# EAGLE board SX-150 Mk II (MIDI THT Proto E7) (EAGLE 7.4.0)
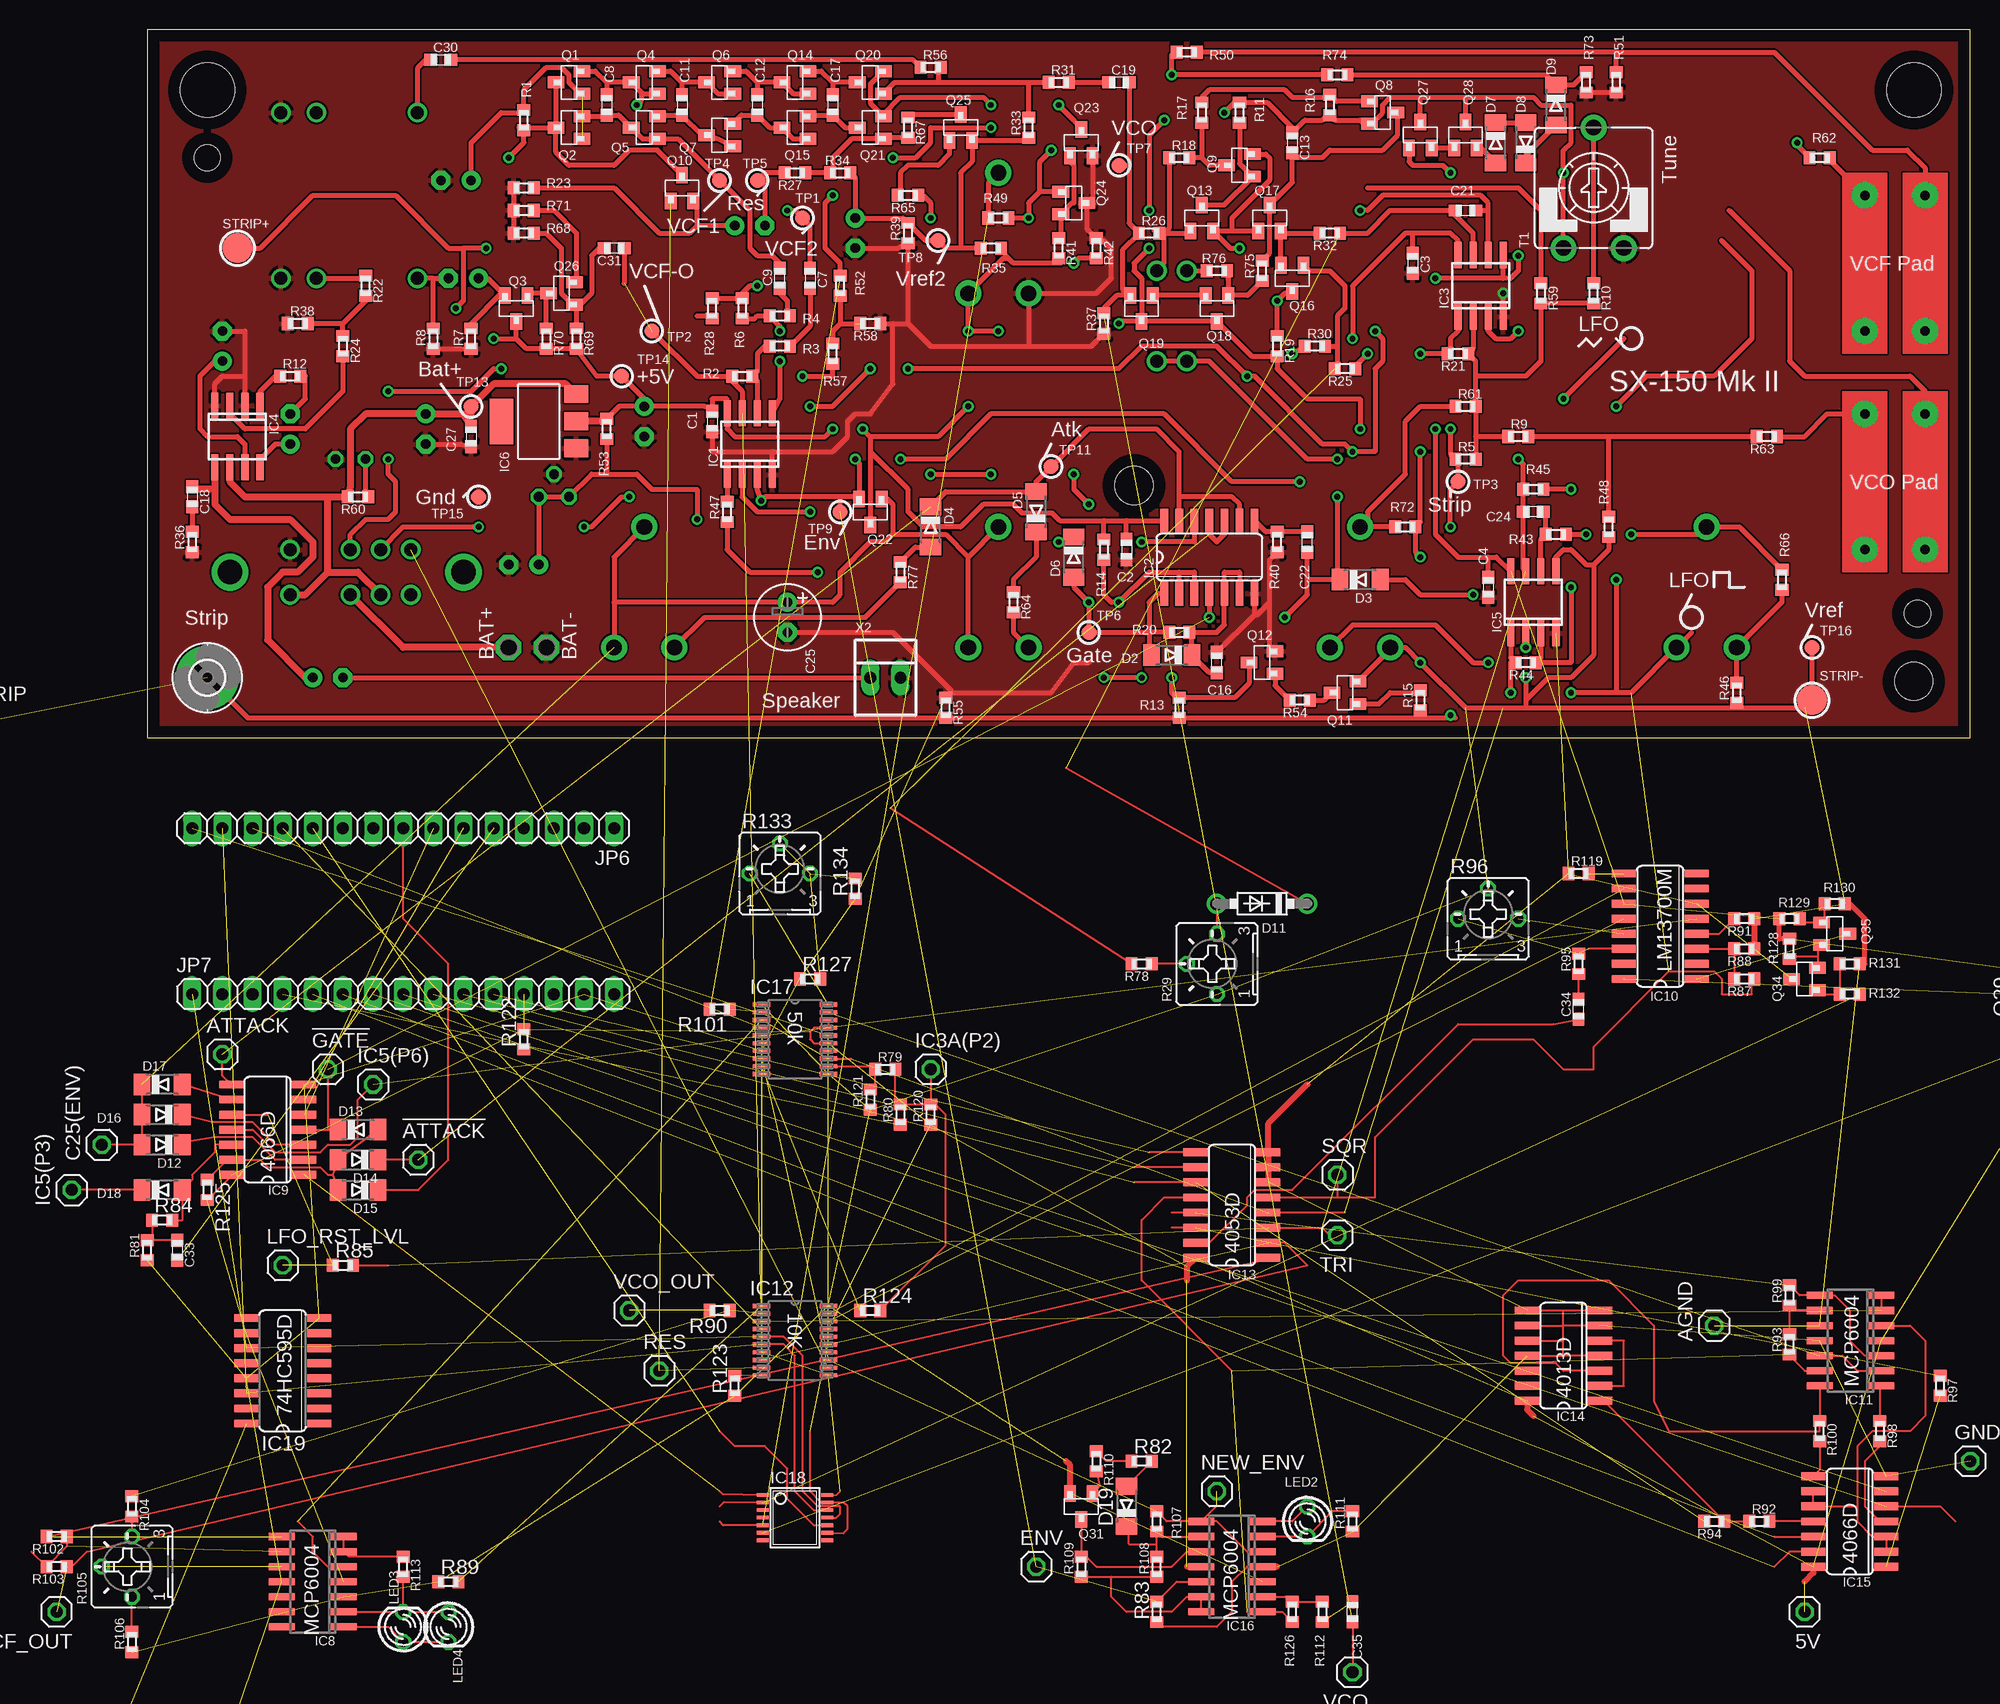
[diagram p2: board, top side]
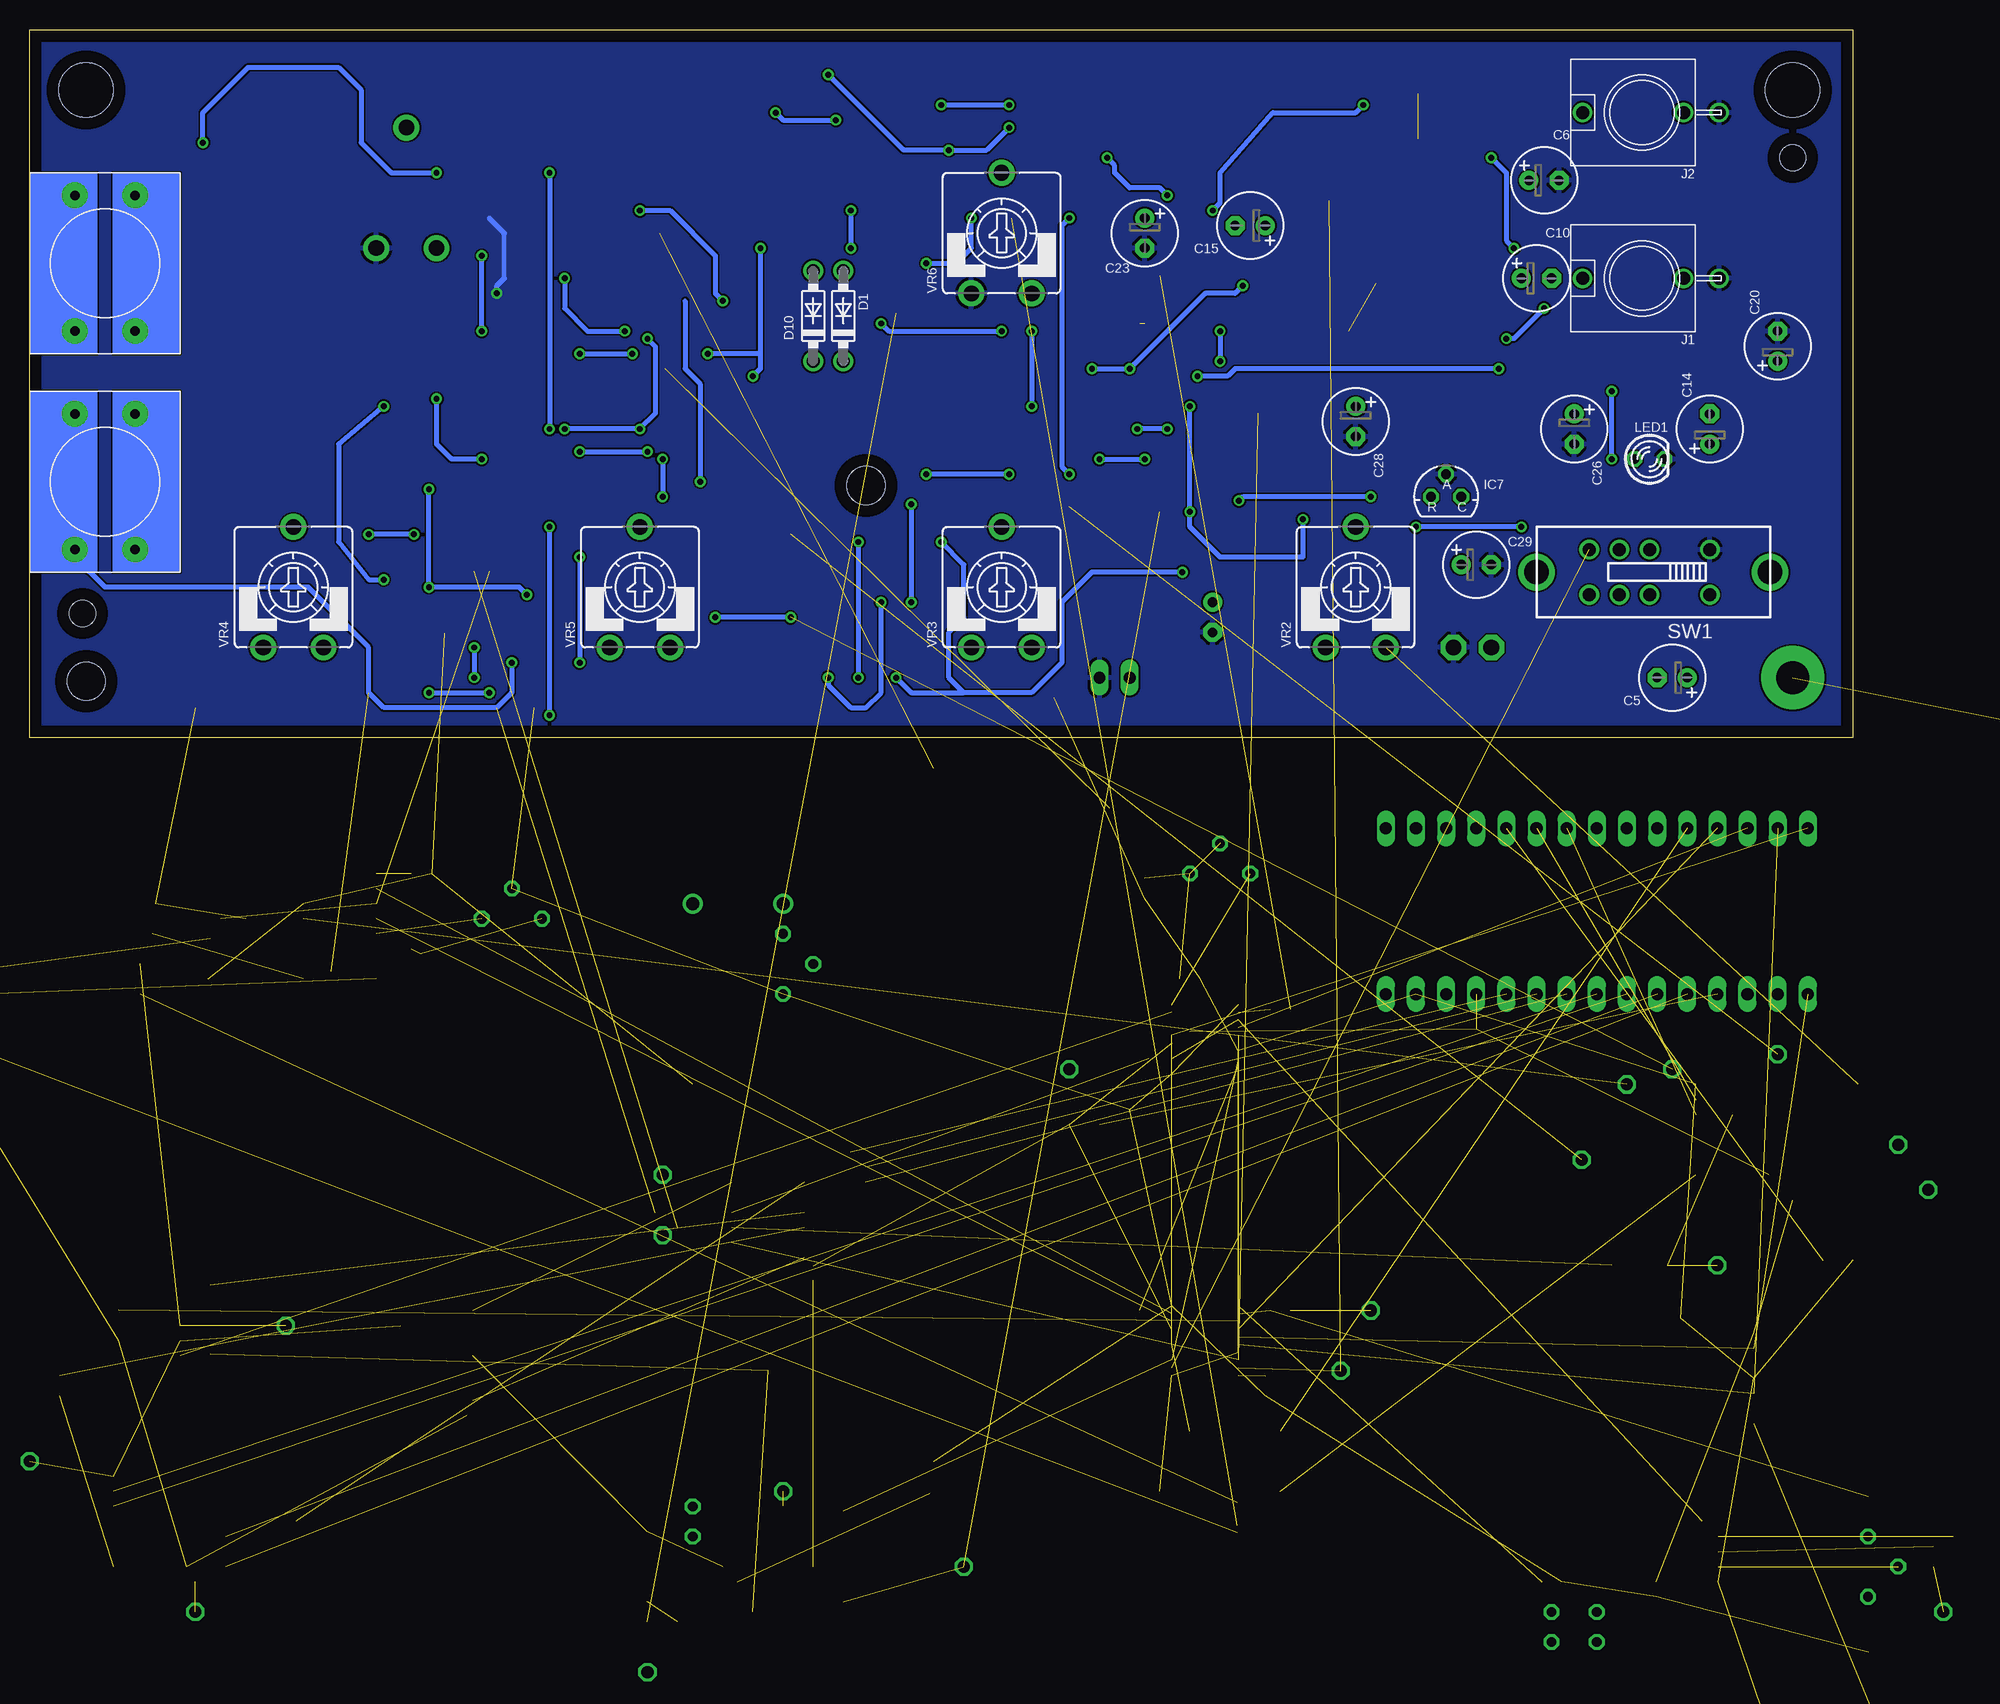
[diagram p3: board, bottom side, seen from below]

Size 153.67 x 59.69 mm. Coordinates in mm from the lower left corner, seen from the top.
Outline: 0,0 153.65,0 153.67,59.69 0,59.69 0,0
Copper layers (1*16): Top 0.035mm / dielectric 1.5mm / Bottom 0.035mm
Design rules "default": minimum track width 6mil, minimum drill 0.35mm, track to track 6mil, track to pad 6mil, pad to pad 6mil, via to via 6mil, smd to smd 6mil, copper to edge 40mil, drill to drill 6mil, minimum pad ring 10mil, minimum via ring 8mil, stop-mask expansion 4mil, vias tented up to drill 0mil, thermal gap 10mil
Net classes: 1 power: width 0.508 mm
Holes 3.2 mm at 83.19,21.27 148.91,4.76
Holes 4.57 mm at 148.91,54.61 5.08,54.61
Holes 2.2 mm at 5.08,48.9 149.22,10.48

## Footprints (pad centres in the part's own frame; a part is rotated, then mirrored left to right if it is on the bottom)
1X01 = drill 1.016 octagon: 1 0,0
P1-13 = drill 1.321 pad 2.159 octagon: TP 0,0
C0603 = smd 1.1 x 1: 1 -0.85,0; 2 0.85,0
E2,5-6 = drill 0.813 pad 1.6: + -1.27,0 | drill 0.813 pad 1.6 octagon: - 1.27,0
DO41-7.6 = drill 1.1 pad 1.7: A 3.81,0; C -3.81,0
MINIMELF = smd 1.4 x 1.8: A 1.7,0; C -1.7,0
GAKKEN-PAD = drill 0.8 pad 2.184: A0 -2.54,5.715; A1 -2.54,-5.715; B0 2.54,5.715; B1 2.54,-5.715
2,8-PAD = drill 2.8 pad 5.334: B2,8 0,0
SO08 = smd 0.6 x 2.2: 1 -1.905,-2.6; 2 -0.635,-2.6; 3 0.635,-2.6; 4 1.905,-2.6; 5 1.905,2.6; 6 0.635,2.6; 7 -0.635,2.6; 8 -1.905,2.6
SO14 = smd 0.66 x 2.032: 1 -3.81,-3.073; 2 -2.54,-3.073; 3 -1.27,-3.073; 4 0,-3.073; 5 1.27,-3.073; 6 2.54,-3.073; 7 3.81,-3.073; 8 3.81,3.073; 9 2.54,3.073; 10 1.27,3.073; 11 0,3.073; 12 -1.27,3.073; 13 -2.54,3.073; 14 -3.81,3.073
SOT223 = smd 1.499 x 2.007: 1 -2.261,-3.15; 2 0.025,-3.15; 3 2.311,-3.15 | smd 3.81 x 2.007: 4 0,3.15
TO92-CLP = drill 0.813 octagon: A 0,1.905; C 1.27,0; R -1.27,0
SO14' = smd 0.6 x 2.2: 1 -3.81,-2.6; 2 -2.54,-2.6; 3 -1.27,-2.6; 4 0,-2.6; 5 1.27,-2.6; 6 2.54,-2.6; 7 3.81,-2.6; 8 3.81,2.6; 9 2.54,2.6; 10 1.27,2.6; 11 0,2.6; 12 -1.27,2.6; 13 -2.54,2.6; 14 -3.81,2.6
SO16 = smd 0.66 x 2.032: 1 -4.445,-3.073; 2 -3.175,-3.073; 3 -1.905,-3.073; 4 -0.635,-3.073; 5 0.635,-3.073; 6 1.905,-3.073; 7 3.175,-3.073; 8 4.445,-3.073; 9 4.445,3.073; 10 3.175,3.073; 11 1.905,3.073; 12 0.635,3.073; 13 -0.635,3.073; 14 -1.905,3.073; 15 -3.175,3.073; 16 -4.445,3.073
TSSOP20_MC_MCH = smd 1.473 x 0.356: 1 -2.819,2.925; 2 -2.819,2.275; 3 -2.819,1.625; 4 -2.819,0.975; 5 -2.819,0.325; 6 -2.819,-0.325; 7 -2.819,-0.975; 8 -2.819,-1.625; 9 -2.819,-2.275; 10 -2.819,-2.925; 11 2.819,-2.925; 12 2.819,-2.275; 13 2.819,-1.625; 14 2.819,-0.975; 15 2.819,-0.325; 16 2.819,0.325; 17 2.819,0.975; 18 2.819,1.625; 19 2.819,2.275; 20 2.819,2.925
TSSOP14 = smd 0.305 x 0.991: 1 -1.905,-2.718; 2 -1.27,-2.718; 3 -0.635,-2.718; 4 0,-2.718; 5 0.635,-2.718; 6 1.27,-2.718; 7 1.905,-2.718; 8 1.905,2.718; 9 1.27,2.718; 10 0.635,2.718; 11 0,2.718; 12 -0.635,2.718; 13 -1.27,2.718; 14 -1.905,2.718
JACK-3.5-NOHOLE = drill 1.1: 1 0,5; 2 0,-3.5; 3 0,-6.5
1X15 = drill 1.016 long: 1 -17.78,0; 2 -15.24,0; 3 -12.7,0; 4 -10.16,0; 5 -7.62,0; 6 -5.08,0; 7 -2.54,0; 8 0,0; 9 2.54,0; 10 5.08,0; 11 7.62,0; 12 10.16,0; 13 12.7,0; 14 15.24,0; 15 17.78,0
LED3MM = drill 0.813 octagon: A -1.27,0; K 1.27,0
SOT23-BEC = smd 1 x 1.4: B -0.95,-1.1; C 0,1.1; E 0.95,-1.1
R0603 = smd 1 x 1.1: 1 -0.85,0; 2 0.85,0
B25P = drill 0.813 octagon: A -2.54,0; E 2.54,0; S 0,2.54
B2,54 = smd 2.54 x 2.54: TP 0,0
SP3T = drill 1.1: 0 -4.445,1.905; 1 0.635,1.905; 2 3.175,1.905; 3 5.715,1.905; 4 -4.445,-1.905; 5 0.635,-1.905; 6 3.175,-1.905; 7 5.715,-1.905 | drill 2.083: P$1 -9.525,0; P$2 10.16,0
CA9V = drill 1.321 pad 2.184: A -2.54,-5.08; E 2.54,-5.08; S 0,5.08
B1,27 = smd 1.27 x 1.27: TP 0,0
22-23-2021 = drill 1 long: 1 -1.27,0; 2 1.27,0

## Placement (x,y rotation side)
5V  [1X01]  139.7,-73.66 180 top  (outside the outline)
!ATTACK  [1X01]  22.86,-35.56 0 top  (outside the outline)
!GATE  [1X01]  15.24,-27.94 0 top  (outside the outline)
AGND  [1X01]  132.08,-49.53 90 top  (outside the outline)
ATTACK  [1X01]  6.35,-26.67 0 top  (outside the outline)
BAT+  TPPAD1-13  [P1-13]  30.48,7.62 90 top
BAT-  TPPAD1-13  [P1-13]  33.66,7.62 90 top
C1  100n  [C0603]  47.62,26.67 270 top
C2  100n  [C0603]  82.55,15.88 270 top
C3  100n  [C0603]  106.68,40.01 270 top
C4  100n  [C0603]  113.03,12.7 270 top
C5  220u  [E2,5-6]  15.24,5.08 180 bottom
C6  10u/16v  [E2,5-6]  26.04,46.99 0 bottom
C7  100n  [C0603]  55.88,38.73 270 top
C8  33n  [C0603]  38.73,53.34 270 top
C9  100n  [C0603]  53.34,38.73 90 top
C10  10u/10v  [E2,5-6]  26.67,38.73 0 bottom
C11  33n  [C0603]  45.09,53.34 270 top
C12  33n  [C0603]  51.44,53.34 270 top
C13  33n  [C0603]  96.52,50.16 270 top
C14  10u/10v  [E2,5-6]  12.06,26.04 90 bottom
C15  4.7u/10V  [E2,5-6]  50.8,43.18 180 bottom
C16  33n  [C0603]  90.17,6.35 90 top
C17  12n  [C0603]  57.78,53.34 270 top
C18  47n  [C0603]  3.81,20.32 270 top
C19  1u  [C0603]  81.92,55.24 180 top
C20  10u/10v  [E2,5-6]  6.35,33.02 90 bottom
C21  1n  [C0603]  111.12,44.45 180 top
C22  100p  [C0603]  97.79,16.51 90 top
C23  220u/5v  [E2,5-6]  59.69,42.55 270 bottom
C24  100n  [C0603]  116.84,19.05 180 top
C25  100u/16v  [E2,5-6]  53.98,10.16 270 top
C25(ENV)  [1X01]  -3.81,-34.29 90 top  (outside the outline)
C26  100u/16v  [E2,5-6]  23.5,26.04 270 bottom
C27  100n  [C0603]  27.3,25.4 270 top
C28  100u/16v  [E2,5-6]  41.91,26.67 270 bottom
C29  220u/10v  [E2,5-6]  31.75,14.61 0 bottom
C30  4.7u  [C0603]  24.77,57.15 0 top
C31  4.7u  [C0603]  39.37,41.27 180 top
C33  1n  [C0603]  2.54,-43.18 270 top  (outside the outline)
C34  4.7u  [C0603]  120.65,-22.86 90 top  (outside the outline)
C35  1u  [C0603]  101.6,-73.66 90 top  (outside the outline)
D1  [DO41-7.6]  85.09,35.56 90 bottom
D2  [MINIMELF]  86.36,6.99 180 top
D3  [MINIMELF]  102.23,13.34 0 top
D4  [MINIMELF]  66.04,17.78 270 top
D5  [MINIMELF]  74.93,19.05 90 top
D6  [MINIMELF]  78.11,15.24 270 top
D7  [MINIMELF]  113.67,50.16 270 top
D8  [MINIMELF]  116.2,50.16 90 top
D9  [MINIMELF]  118.75,53.34 270 top
D10  [DO41-7.6]  87.63,35.56 90 bottom
D11  [DO41-7.6]  93.98,-13.97 180 top  (outside the outline)
D12  [MINIMELF]  1.27,-34.29 180 top  (outside the outline)
D13  [MINIMELF]  17.78,-33.02 0 top  (outside the outline)
D14  [MINIMELF]  17.78,-35.56 180 top  (outside the outline)
D15  [MINIMELF]  17.78,-38.1 180 top  (outside the outline)
D16  [MINIMELF]  1.27,-31.75 180 top  (outside the outline)
D17  [MINIMELF]  1.27,-29.21 0 top  (outside the outline)
D18  [MINIMELF]  1.27,-38.1 0 top  (outside the outline)
D19  [MINIMELF]  82.55,-64.77 90 top  (outside the outline)
ENV  [1X01]  74.93,-69.85 0 top  (outside the outline)
FINGERPAD2  GAKKEN-PAD  [GAKKEN-PAD]  147.32,21.59 0 bottom
GND  [1X01]  153.67,-60.96 0 top  (outside the outline)
H1  MOUNT-PAD-ROUND2.8  [2,8-PAD]  5.08,5.08 0 top
IC1  LM358D  [SO08]  50.8,24.77 0 top
IC2  74HC02D  [SO14]  89.53,15.24 0 top
IC3  LM358D  [SO08]  112.39,38.1 0 top
IC3A(P2)  [1X01]  66.04,-27.94 0 top  (outside the outline)
IC4  LM386M-1  [SO08]  7.62,25.4 180 top
IC5  NJU7096  [SO08]  116.84,11.43 0 top
IC5(P3)  [1X01]  -6.35,-38.1 90 top  (outside the outline)
IC5(P6)  [1X01]  19.05,-29.21 0 top  (outside the outline)
IC6  REG1117  [SOT223]  33.02,26.67 90 top
IC7  TL431  [TO92-CLP]  34.29,20.32 0 bottom
IC8  MCP6004  [SO14']  13.97,-71.12 90 top  (outside the outline)
IC9  4066D  [SO14]  10.16,-33.02 90 top  (outside the outline)
IC10  LM13700M  [SO16]  127.53,-15.88 90 top  (outside the outline)
IC11  MCP6004  [SO14']  143.57,-50.8 90 top  (outside the outline)
IC12  10K  [TSSOP20_MC_MCH]  54.61,-50.8 0 top  (outside the outline)
IC13  4053D  [SO16]  91.44,-39.37 90 top  (outside the outline)
IC14  4013D  [SO14]  119.38,-52.07 90 top  (outside the outline)
IC15  4066D  [SO14]  143.51,-66.04 90 top  (outside the outline)
IC16  MCP6004  [SO14']  91.44,-69.85 90 top  (outside the outline)
IC17  50k  [TSSOP20_MC_MCH]  54.61,-25.4 0 top  (outside the outline)
IC18  BD79702FV  [TSSOP14]  54.61,-65.72 270 top  (outside the outline)
IC19  74HC595D  [SO16]  11.43,-53.34 90 top  (outside the outline)
IC20  4051D  [SO16]  -7.62,-110.49 0 top  (outside the outline)
J1  PJ301M  [JACK-3.5-NOHOLE]  17.78,38.73 90 bottom
J2  Line In  [JACK-3.5-NOHOLE]  17.78,52.7 90 bottom
JP6  [1X15]  21.59,-7.62 180 top  (outside the outline)
JP7  [1X15]  21.59,-21.59 0 top  (outside the outline)
LED1  [LED3MM]  17.14,23.5 0 bottom
LED2  [LED3MM]  97.79,-66.04 270 top  (outside the outline)
LED3  [LED3MM]  21.59,-74.93 90 top  (outside the outline)
LED4  [LED3MM]  25.4,-74.93 270 top  (outside the outline)
LFO_RST_LVL  [1X01]  11.43,-44.45 0 top  (outside the outline)
NEW_ENV  [1X01]  90.17,-63.5 0 top  (outside the outline)
PAD1  GAKKEN-PAD  [GAKKEN-PAD]  147.32,40.01 180 bottom
Q1  2SC2712  [SOT23-BEC]  35.56,55.24 90 top
Q2  2SC2712  [SOT23-BEC]  35.56,51.44 90 top
Q3  2SC2712  [SOT23-BEC]  31.11,36.2 180 top
Q4  2SC2712  [SOT23-BEC]  41.91,55.24 90 top
Q5  2SC2712  [SOT23-BEC]  41.91,51.44 90 top
Q6  2SC2712  [SOT23-BEC]  48.26,55.24 90 top
Q7  2SC2712  [SOT23-BEC]  48.26,50.8 90 top
Q8  2SA1162  [SOT23-BEC]  104.14,52.7 270 top
Q9  2SC2712  [SOT23-BEC]  92.08,48.26 90 top
Q10  2SC2712  [SOT23-BEC]  45.09,46.35 0 top
Q11  2SA1162  [SOT23-BEC]  100.97,3.81 90 top
Q12  2SC2712  [SOT23-BEC]  93.98,6.35 90 top
Q13  2SC2712  [SOT23-BEC]  88.9,43.81 0 top
Q14  2SC2712  [SOT23-BEC]  54.61,55.24 90 top
Q15  2SC2712  [SOT23-BEC]  54.61,51.44 90 top
Q16  2SC2712  [SOT23-BEC]  96.52,38.73 180 top
Q17  2SC2712  [SOT23-BEC]  94.61,43.81 0 top
Q18  2SC2712  [SOT23-BEC]  90.17,36.2 180 top
Q19  2SC2712  [SOT23-BEC]  83.82,36.2 180 top
Q20  2SC2712  [SOT23-BEC]  60.96,55.24 90 top
Q21  2SC2712  [SOT23-BEC]  60.96,51.44 90 top
Q22  2SC2712  [SOT23-BEC]  60.96,19.05 180 top
Q23  2SC2712  [SOT23-BEC]  78.74,50.16 0 top
Q24  2SA1162  [SOT23-BEC]  78.11,45.09 270 top
Q25  2SC2712  [SOT23-BEC]  68.58,51.44 0 top
Q26  2SC2712  [SOT23-BEC]  34.92,37.47 90 top
Q27  2SC2712  [SOT23-BEC]  107.31,50.8 0 top
Q28  2SC2712  [SOT23-BEC]  111.12,50.8 0 top
Q29  2SA1162  [SOT23-BEC]  158.75,-21.59 90 top  (outside the outline)
Q31  2SC2712  [SOT23-BEC]  78.74,-64.77 180 top  (outside the outline)
Q34  2SA1162  [SOT23-BEC]  139.7,-20.32 90 top  (outside the outline)
Q35  2SA1162  [SOT23-BEC]  142.24,-16.51 270 top  (outside the outline)
R1  10k  [R0603]  31.75,52.07 270 top
R2  2.2M  [R0603]  50.16,30.48 180 top
R3  47k  [R0603]  53.34,33.02 180 top
R4  47k  [R0603]  53.34,35.56 180 top
R5  1M  [R0603]  111.12,23.5 0 top
R6  47k  [R0603]  50.16,36.2 270 top
R7  4.7k  [R0603]  27.3,33.66 90 top
R8  100k  [R0603]  24.13,33.66 90 top
R9  2.2M  [R0603]  115.57,25.4 180 top
R10  1M  [R0603]  121.92,37.47 270 top
R11  22k  [R0603]  92.08,52.7 90 top
R12  10k  [R0603]  12.06,30.48 0 top
R13  1M  [R0603]  87,2.54 90 top
R14  1M  [R0603]  80.64,15.88 90 top
R15  10k  [R0603]  107.31,3.17 90 top
R16  680Ω  [R0603]  99.69,53.34 270 top
R17  1k  [R0603]  88.9,52.7 90 top
R18  68k  [R0603]  87,48.9 0 top
R19  220k  [R0603]  95.25,33.02 270 top
R20  220k  [R0603]  87,8.89 0 top
R21  470k  [R0603]  110.49,32.38 180 top
R22  47k  [R0603]  18.41,38.1 270 top
R23  22k  [R0603]  31.75,46.35 0 top
R24  0Ω  [R0603]  16.51,33.02 270 top
R25  33k  [R0603]  100.97,31.11 180 top
R26  47k  [R0603]  84.45,42.55 0 top
R27  2.2k  [R0603]  54.61,47.62 180 top
R28  1k  [R0603]  47.62,36.2 270 top
R29  5k  [B25P]  90.17,-19.05 90 top  (outside the outline)
R30  2.2k  [R0603]  98.42,33.02 0 top
R31  47k  [R0603]  76.83,55.24 180 top
R32  1k  [R0603]  99.69,42.55 180 top
R33  2.2k  [R0603]  74.3,51.44 90 top
R34  2.2k  [R0603]  58.42,47.62 180 top
R35  6.8k  [R0603]  71.12,41.27 0 top
R36  10Ω  [R0603]  3.81,16.51 90 top
R37  10k  [R0603]  80.64,34.92 90 top
R38  1.5k  [R0603]  12.7,34.92 0 top
R39  2.4k  [R0603]  64.14,42.55 90 top
R40  330k  [R0603]  95.25,16.51 90 top
R41  2.2M  [R0603]  76.83,41.27 270 top
R42  2.2k  [R0603]  80.01,41.27 270 top
R43  22k  [R0603]  118.75,17.14 0 top
R44  47k  [R0603]  116.2,6.35 180 top
R45  22k  [R0603]  116.84,20.95 0 top
R46  10Ω  [R0603]  133.99,3.81 90 top
R47  330k  [R0603]  48.9,19.05 90 top
R48  1k  [R0603]  123.19,17.78 90 top
R49  56k  [R0603]  71.75,43.81 0 top
R50  27k  [R0603]  87.63,57.78 180 top
R51  1k  [R0603]  123.83,55.24 90 top
R52  27k  [R0603]  58.42,38.1 90 top
R53  1k  [R0603]  38.73,26.04 90 top
R54  10k  [R0603]  97.16,3.17 180 top
R55  1M  [R0603]  67.31,2.54 270 top
R56  22k  [R0603]  66.04,56.52 0 top
R57  4.7k  [R0603]  57.78,32.38 90 top
R58  4.7k  [R0603]  60.96,34.92 180 top
R59  1M  [R0603]  117.47,37.47 270 top
R60  2.2k  [R0603]  17.78,20.32 180 top
R61  2.2M  [R0603]  111.12,27.94 0 top
R62  1k  [R0603]  140.97,48.9 180 top
R63  4.7k  [R0603]  136.53,25.4 180 top
R64  120Ω  [R0603]  73.03,11.43 270 top
R65  39k  [R0603]  64.14,45.72 180 top
R66  2.2k  [R0603]  137.79,13.34 90 top
R67  1k  [R0603]  64.14,51.44 270 top
R68  100k  [R0603]  31.75,42.55 0 top
R69  220k  [R0603]  36.2,33.66 270 top
R70  22k  [R0603]  33.66,33.66 270 top
R71  10k  [R0603]  31.75,44.45 0 top
R72  33k  [R0603]  106.05,17.78 180 top
R73  4.7k  [R0603]  121.28,55.24 90 top
R74  120k  [R0603]  100.33,55.88 180 top
R75  10k  [R0603]  93.98,39.37 90 top
R76  27k  [R0603]  90.17,39.37 0 top
R77  0Ω  [R0603]  63.5,13.97 270 top
R78  470k  [R0603]  83.82,-19.05 180 top  (outside the outline)
R79  470k  [R0603]  62.23,-27.94 0 top  (outside the outline)
R80  120k  [R0603]  63.5,-31.75 90 top  (outside the outline)
R81  100k  [R0603]  0,-43.18 90 top  (outside the outline)
R82  100k  [R0603]  83.82,-60.96 0 top  (outside the outline)
R83  10k  [R0603]  85.09,-73.66 90 top  (outside the outline)
R84  1k  [R0603]  1.27,-40.64 0 top  (outside the outline)
R85  4.7k  [R0603]  16.51,-44.45 0 top  (outside the outline)
R86  10k  [R0603]  162.56,-20.32 0 top  (outside the outline)
R87  100k  [R0603]  134.62,-20.32 180 top  (outside the outline)
R88  1k  [R0603]  134.62,-17.78 180 top  (outside the outline)
R89  3.3k  [R0603]  25.4,-71.12 0 top  (outside the outline)
R90  10k  [R0603]  48.26,-48.26 180 top  (outside the outline)
R91  1k  [R0603]  134.62,-15.24 180 top  (outside the outline)
R92  33k  [R0603]  135.89,-66.04 0 top  (outside the outline)
R93  100k  [R0603]  138.43,-51.12 90 top  (outside the outline)
R94  22k  [R0603]  132.08,-66.04 180 top  (outside the outline)
R95  47k  [R0603]  120.65,-19.05 90 top  (outside the outline)
R96  1k  [B25P]  113.03,-15.24 0 top  (outside the outline)
R97  24.9k  [R0603]  151.13,-54.61 270 top  (outside the outline)
R98  100k  [R0603]  146.05,-58.42 270 top  (outside the outline)
R99  100k  [R0603]  138.43,-46.99 90 top  (outside the outline)
R100  100k  [R0603]  140.97,-58.42 270 top  (outside the outline)
R101  100k?  [R0603]  48.26,-22.86 180 top  (outside the outline)
R102  100k  [R0603]  -7.62,-67.31 180 top  (outside the outline)
R103  100k  [R0603]  -7.62,-69.85 180 top  (outside the outline)
R104  100k  [R0603]  -1.27,-64.77 270 top  (outside the outline)
R105  50k  [B25P]  -1.27,-69.85 90 top  (outside the outline)
R106  10k  [R0603]  -1.27,-76.2 90 top  (outside the outline)
R107  100k  [R0603]  85.09,-66.04 90 top  (outside the outline)
R108  100k  [R0603]  85.09,-69.85 90 top  (outside the outline)
R109  100k  [R0603]  78.74,-69.85 90 top  (outside the outline)
R110  47k  [R0603]  80.01,-60.96 270 top  (outside the outline)
R111  2.2k  [R0603]  101.6,-66.04 90 top  (outside the outline)
R112  100k  [R0603]  99.06,-73.66 90 top  (outside the outline)
R113  1k  [R0603]  21.59,-69.85 270 top  (outside the outline)
R116  470k  [R0603]  162.56,-22.86 0 top  (outside the outline)
R117  100k  [R0603]  161.29,-25.4 0 top  (outside the outline)
R119  4.7k  [R0603]  120.65,-11.43 0 top  (outside the outline)
R120  1M  [R0603]  66.04,-31.75 90 top  (outside the outline)
R121  33k  [R0603]  60.96,-30.48 90 top  (outside the outline)
R122  10Ω  [R0603]  31.75,-25.4 90 top  (outside the outline)
R123  1k  [R0603]  49.53,-54.61 90 top  (outside the outline)
R124  470k  [R0603]  60.96,-48.26 0 top  (outside the outline)
R125  10k  [R0603]  5.08,-38.1 270 top  (outside the outline)
R126  220k  [R0603]  96.52,-73.66 270 top  (outside the outline)
R127  68k  [R0603]  55.88,-20.32 0 top  (outside the outline)
R128  4.7k  [R0603]  138.43,-17.78 90 top  (outside the outline)
R129  33k  [R0603]  138.43,-15.24 180 top  (outside the outline)
R130  2.2k  [R0603]  142.24,-13.97 180 top  (outside the outline)
R131  2.2k  [R0603]  143.51,-19.05 180 top  (outside the outline)
R132  47k  [R0603]  143.51,-21.59 180 top  (outside the outline)
R133  20k  [B25P]  53.34,-11.43 0 top  (outside the outline)
R134  100k  [R0603]  59.69,-12.7 90 top  (outside the outline)
RES  [1X01]  43.18,-53.34 0 top  (outside the outline)
SQR  [1X01]  100.33,-36.83 0 top  (outside the outline)
STRIP  [1X01]  -13.97,1.27 0 top  (outside the outline)
STRIP+  TPB2,54  [B2,54]  7.62,41.27 0 top
STRIP-  TPB2,54  [B2,54]  140.34,3.17 0 top
SW1  SP3T  [SP3T]  16.51,13.97 180 bottom
T1  50k  [CA9V]  121.92,46.35 0 top
TP1  PTR1B1,27  [B1,27]  55.24,43.81 180 top
TP2  PTR1B1,27  [B1,27]  42.55,34.29 0 top
TP3  PTR1B1,27  [B1,27]  110.49,21.59 0 top
TP4  PTR1B1,27  [B1,27]  48.26,46.99 0 top
TP5  PTR1B1,27  [B1,27]  51.44,46.99 0 top
TP6  PTR1B1,27  [B1,27]  79.38,8.89 90 top
TP7  PTR1B1,27  [B1,27]  81.92,48.26 0 top
TP8  PTR1B1,27  [B1,27]  66.67,41.91 0 top
TP9  PTR1B1,27  [B1,27]  58.42,19.05 180 top
TP11  PTR1B1,27  [B1,27]  76.2,22.86 0 top
TP13  PTR1B1,27  [B1,27]  27.3,27.94 0 top
TP14  PTR1B1,27  [B1,27]  40.01,30.48 0 top
TP15  PTR1B1,27  [B1,27]  27.94,20.32 180 top
TP16  PTR1B1,27  [B1,27]  140.34,7.62 0 top
TRI  [1X01]  100.33,-41.91 180 top  (outside the outline)
VCF_OUT  [1X01]  -7.62,-73.66 180 top  (outside the outline)
VCO  [1X01]  101.6,-78.74 180 top  (outside the outline)
VCO_OUT  [1X01]  40.64,-48.26 0 top  (outside the outline)
VR2  50k  [CA9V]  41.91,12.7 0 bottom
VR3  10k  [CA9V]  71.75,12.7 0 bottom
VR4  50k  [CA9V]  131.44,12.7 0 bottom
VR5  50k  [CA9V]  102.23,12.7 0 bottom
VR6  10k  [CA9V]  71.75,42.55 0 bottom
X2  Speaker Out  [22-23-2021]  62.23,5.08 0 top

## Tracks (layer width: path | path; a pad name or v marks a point on that pad's centre or on a via)
!ATTACK  (1 unrouted)
  Top 0.152: !ATTACK.1 D14.C
  Top 0.406: IC2.11 89.53,17.14 90.17,16.51 90.81,17.14 IC2.10
!CS1  (1 unrouted)
!CS2  (1 unrouted)
!CS3  (1 unrouted)
  Top 0.152: IC18.10 56.23,-66.39 53.98,-64.14 53.98,-61.59 52.07,-59.69 49.53,-59.69 48.26,-58.42
!GATE  (via drill 0.5)  (1 unrouted)
  Top 0.152: IC9.4 15.24,-33.02 | 15.24,-33.02 D13.C | !GATE.1 15.24,-33.02
  Top 0.406: IC2.4 v89.53,10.16 | v95.89,10.16 97.79,12.06 97.79,13.34 | 97.79,13.34 C22.1 | D3.C 100.33,13.34 | 100.33,13.34 97.79,13.34 | D1.C D10.C 89.53,31.75 97.79,23.5 v100.33,23.5 | v100.33,20.32 100.33,13.34
  Bottom 0.406: v89.53,10.16 v95.89,10.16 | v100.33,23.5 v100.33,20.32
!SAW  (1 unrouted)
  Top 0.152: R99.2 139.28,-46.99 IC11.8 142.24,-46.99 143.51,-48.26 143.51,-50.8 144.78,-52.07 IC11.3 | IC13.13 86.36,-40.01
+5V  (via drill 0.5)  (20 unrouted)
  Top 0.152: IC17.18 IC17.17 56.22,-24.43 55.88,-24.77 55.88,-25.4 56.2,-25.73 IC17.15 | R125.2 7.09,-36.94 IC9.14 | IC18.9 58.69,-67.05 59.05,-66.67 59.05,-64.77 58.73,-64.44 IC18.13 56.83,-64.44 55.88,-63.5 55.88,-58.42
  Top 0.406: Q1.C Q2.C | Q2.C 31.33,51.44 R1.2 31.75,50.16 v30.48,48.9 | Q10.C 43.01,49.53 40.64,49.53 39.37,48.26 35.56,48.26 34.46,49.36 Q2.C | v28.57,41.27 26.67,41.27 | 26.67,41.27 25.4,41.27 20.95,45.72 13.97,45.72 9.53,41.27 STRIP+.TP | 26.67,41.27 26.67,36.83 v26.04,36.2 | v29.21,33.66 31.11,33.66 | 31.11,33.66 Q3.C | 31.11,33.66 31.96,32.8 R70.2 R69.2 37.88,30.48 TP14.TP 41.91,28.57 C28.+ | Q27.C 107.31,53.98 | 107.31,53.98 111.12,53.98 | 107.31,53.98 104.78,53.98 104.14,53.34 104.14,52.7 103.19,51.76 Q8.E 102.55,51.76 102.23,52.07 100.11,52.07 R16.2 99.48,52.49 99.06,52.07 97.58,52.07 C13.1 96.52,51.44 94.4,53.55 R11.2 91.66,53.55 v90.81,52.7 | R41.2 77.05,40.01 73.03,40.01 72.61,40.42 | 72.61,40.42 R35.2 | 72.61,40.42 72.17,40.42 VR6.E v69.22,34.29 v71.75,34.29 | Q19.C Q18.C 93.09,32.17 R19.2 95.25,31.11 97.79,28.57 102.23,28.57 v102.23,26.04 | 60.96,24.13 64.14,20.95 64.14,19.05 65.41,17.78 68.58,17.78 70.48,19.68 73.03,19.68 73.76,18.95 76.3,18.95 76.94,18.31 80.64,18.31 | 60.96,24.13 Q22.C | v57.78,26.04 57.15,25.4 49.53,25.4 48.9,26.04 IC1.8 48.9,28.57 47.62,28.57 C1.1 46.99,27.94 C28.+ | 60.96,25.4 60.96,24.13 | IC3.8 110.49,41.91 109.86,42.55 106.68,42.55 | 106.68,42.55 106.05,42.55 101.6,38.1 v101.6,33.66 | v108.58,26.04 108.58,17.14 110.49,15.24 113.03,15.24 | 113.03,15.24 113.72,15.24 IC5.8 | Q28.C 111.12,53.98 | 111.12,53.98 116.84,53.98 117.47,53.34 120.02,53.34 120.02,50.16 119.38,49.53 v119.38,47.62 T1.A | C4.1 113.03,15.24 | C3.1 106.68,42.55 | Q19.C 82.08,35.09 v81.92,34.92 | v69.22,27.94 66.67,25.4 60.96,25.4 | 60.96,25.4 v60.33,26.04 | C28.+ 39.79,27.94 R53.2
  Top 0.406: v85.72,52.07 84.45,50.8 v84.45,44.45 | v84.45,41.27 83.19,40.01 83.19,39.37 83.82,38.73 Q19.C | 80.64,18.31 82.55,18.31 | 82.55,18.31 IC2.14 | R14.2 80.64,18.31 | C2.1 82.55,18.31 | v139.06,50.16 139.06,49.95 R62.2 | R128.2 137.58,-16.93 R129.2
  Top 0.508: IC15.14 140.44,-70.38 139.7,-71.12 | IC14.14 116.31,-56.62 116.84,-57.15 | IC16.11 87.63,-69.85 | IC13.16 87.63,-44.55 87.63,-45.72
  Top 0.61: R53.2 38.29,26.7 IC6.2
  Bottom 0.406: v30.48,48.9 29.21,47.62 29.21,41.91 v28.57,41.27 | v57.78,26.04 v60.33,26.04 | v101.6,33.66 100.97,33.02 100.97,27.3 v102.23,26.04 v108.58,26.04 | v81.92,34.92 81.28,34.29 v71.75,34.29 | v69.22,34.29 v69.22,27.94 | v139.06,50.16 139.06,52.7 135.25,56.52 127.64,56.52 125.73,54.61 125.73,50.16 123.19,47.62 v119.38,47.62 | v90.81,52.7 90.17,52.07 v85.72,52.07 | v84.45,44.45 v84.45,41.27 | v26.04,36.2 28.57,33.66 v29.21,33.66
AGND  (via drill 0.5)  (16 unrouted)
  Top 0.406: R28.1 R6.1 50.16,37.47 50.8,38.1 v51.44,38.1 | Q9.E 94.3,49.21 94.61,48.9 94.61,46.99 91.44,43.81 91.44,42.72 | Q17.B 91.44,42.72 | 91.44,42.72 Q13.E 91.29,41.27 v92.08,41.27 | IC3.3 113.03,34.29 113.67,33.66 114.94,33.66 v115.57,34.29 | v96.52,32.38 R30.1 | v115.57,40.64 115.57,39.37 114.94,38.73 114.3,38.73 | 114.3,38.73 IC3.5 | IC1.2 50.16,20.32 51.44,19.05 v55.88,19.05 | v55.88,27.94 57.78,27.94 v60.96,31.11 | 118.81,14.03 IC5.5 118.75,15.24 119.38,15.88 120.02,15.88 121.28,14.61 121.92,14.61 | Q11.E 104.78,7.47 VR5.A 106.05,7.62 v107.31,6.35 111.12,2.54 116.2,2.54 | 116.2,2.54 133.99,2.54 | IC5.2 v116.2,7.62 | v116.2,5.08 116.2,3.17 | 116.2,3.17 116.2,2.54 | v107.31,15.24 106.89,15.66 R72.1 107.31,18.2 v107.31,24.13 | v64.14,31.11 81.92,31.11 83.82,33.02 90.17,33.02 v92.71,30.48 93.34,30.48 99.06,24.77 100.97,24.77 v101.6,24.13 103.5,24.13 103.5,31.11 104.14,31.75 104.14,33.66 v103.5,34.29 | TP16.TP STRIP-.TP 139.7,2.54 133.99,2.54 | R46.1 133.99,2.54 | 121.92,14.61 121.92,6.99 120.02,5.08 118.11,5.08 116.2,3.17 | 114.3,38.73 v108.58,38.73 | C29.+ IC7.C IC7.R 37.47,22.23 38.73,22.23 | 38.73,22.23 41.27,22.23 42.55,20.95 46.35,20.95 v46.35,18.41 | R53.1 38.73,22.23 | R48.1 123.19,15.88 121.92,14.61 | R131.1 144.78,-19.05 144.78,-15.24 143.51,-13.97 R130.1
  Top 0.508: R91.1 R88.1 | Q31.E 77.79,-61.28 77.47,-60.96
  Bottom 0.406: v115.57,34.29 v115.57,40.64 | v92.08,41.27 92.08,32.38 | 92.08,32.38 v96.52,32.38 | v51.44,38.1 52.07,37.47 54.61,37.47 v60.96,31.11 v64.14,31.11 | v55.88,27.94 v55.88,19.05 55.88,17.78 53.34,15.24 46.35,15.24 v46.35,18.41 | v116.2,7.62 v116.2,5.08 | v107.31,15.24 v107.31,6.35 | v107.31,24.13 v101.6,24.13 | v108.58,38.73 108.58,36.2 106.68,34.29 v103.5,34.29 | 92.08,32.38 92.08,31.11 v92.71,30.48
ATK_PWM  (1 unrouted)
ATTACK  (1 unrouted)
  Top 0.152: IC9.8 6.35,-28.47 ATTACK.1
  Top 0.406: IC2.13 87,20.32 | 87,20.32 87,24.13 85.09,26.04 79.38,26.04 TP11.TP 74.93,21.59 D5.A 67.31,20.75 D4.C | IC2.9 92.08,19.68 91.44,20.32 87,20.32
C25  (1 unrouted)
  Top 0.152: D17.C D16.A D12.A C25(ENV).1
  Top 0.406: VR3.E 69.22,15.24 | 69.22,15.24 VR3.S | Q22.B 62.4,20.15 62.87,19.68 62.87,17.14 | 62.87,17.14 67.31,17.14 69.22,15.24 | 62.87,17.14 62.23,16.51 60.96,16.51 58.42,13.97 58.42,12.06 57.78,11.43 C25.+ 39.37,11.43 | VR2.S 39.37,15.24 39.37,11.43 | 39.37,11.43 VR2.E
DECAY_PWM
  Top 0.152: D15.C 22.86,-38.1 25.4,-35.56 25.4,-19.05 21.59,-15.24 JP6.8
ENV  (via drill 0.5)  (2 unrouted)
  Top 0.152: R83.2 86.78,-71.12 IC16.12
  Top 0.406: v97.16,21.59 91.44,21.59 85.72,27.3 71.12,27.3 67.31,23.5 v63.5,23.5 | v59.69,23.5 60.01,23.18 Q22.E 59.84,20.32 58.42,20.32 | 58.42,20.32 52.07,20.32 v51.75,20 51.44,20.95 IC1.3 | TP9.TP 58.42,20.32 | SW1.6 21.59,17.78 v27.94,17.78 | v36.83,17.78 37.47,17.78 40.01,20.32 v40.64,20.32
  Bottom 0.406: 98.42,36.83 98.42,31.11 97.16,29.84 v97.16,21.59 | v63.5,23.5 v59.69,23.5 | v27.94,17.78 v36.83,17.78 | v40.64,20.32 51.44,20.32 v51.75,20
ENV_INV
  Top 0.152: R82.1 80.86,-60.96 R110.1
FILTER_OUT
  Top 0.152: C34.1 118.53,-24.13 110.49,-24.13 96.52,-38.1 93.34,-38.1 92.71,-38.73 92.71,-39.37 89.53,-42.55 IC13.15
GATE  (via drill 0.5)
  Top 0.406: IC2.1 85.19,12.17 84.45,11.43 84.45,8.89 | 84.45,8.89 84.45,7.83 D2.A | R20.1 84.45,8.89 | D6.A 78.11,12.7 v79.38,11.43 TP6.TP 84.45,8.89 | R65.1 65.41,45.72 66.04,45.09 v66.04,43.81 | v66.04,22.23 v71.12,22.23 | v78.11,22.23 78.11,20.95 v79.38,19.68
  Bottom 0.406: v66.04,43.81 66.67,43.18 66.67,22.86 v66.04,22.23 | v71.12,22.23 v78.11,22.23 | v79.38,19.68 v79.38,11.43
GND  (via drill 0.5)  (24 unrouted)
  Top 0.152: IC14.8 119.38,-48.26 | 119.38,-48.26 IC14.7 | IC14.10 119.38,-50.8 | 119.38,-50.8 119.38,-49.53 | 119.38,-49.53 119.38,-48.26 | IC14.6 119.38,-49.53 | IC14.4 119.38,-52.07 | 119.38,-52.07 119.38,-50.8 | IC18.14 58.12,-63.8 58.42,-63.5 | IC14.9 119.38,-49.53 | IC14.11 119.38,-52.07 | IC16.4 92.71,-69.85 91.44,-71.12 91.44,-73.66 90.17,-74.93 85.51,-74.93 R83.1
  Top 0.406: R23.1 R71.1 R68.1 | R73.1 R51.1 | 79.06,45.23 Q24.C | C23.- 63.28,41.27 R39.1 64.14,34.92 | R58.1 62.87,34.92 | 62.87,34.92 64.14,34.92 | 64.14,34.92 66.04,33.02 74.3,33.02 | 74.3,33.02 79.59,33.02 R37.1 | 74.3,33.02 VR6.A 80.01,37.47 81.28,38.73 81.28,41.27 80.64,41.91 80.22,41.91 R42.1 79.2,42.93 Q24.C | IC3.4 v114.3,37.47 | C16.2 93.34,10.38 | 93.34,10.38 IC2.7 | Q12.E 94.61,7.76 94.61,11.43 | 94.61,11.43 94.61,15.03 R40.1 | 93.34,10.38 93.56,10.38 94.61,11.43 | C25.- 62.87,8.89 67.94,3.81 76.2,3.81 78.11,6.35 79.38,6.35 | R8.1 R7.1 | C1.2 47.62,24.13 52.7,24.13 | 52.7,24.13 57.78,24.13 59.05,25.4 59.05,26.67 59.69,27.3 60.96,27.3 62.87,29.84 62.87,34.92 | IC1.4 52.7,24.13 | C20.- 8.26,34.29 8.26,30.48 | 8.26,30.48 IC4.2 | IC4.4 5.71,29.84 6.35,30.48 8.26,30.48 | C26.- 26.45,24.77 C27.2 | Q23.E 79.69,45.57 Q24.C
  Top 0.508: IC16.4 95.25,-69.85 | 97.79,-29.21 94.51,-32.49 IC13.8 IC13.7 IC13.6
  Bottom 0.406: v114.3,37.47 114.3,38.1 113.67,38.73 113.67,42.55 114.94,43.81
  pour Top: 0,0 153.67,0 153.67,59.69 0,59.69
  pour Bottom: 0,0 153.67,0 153.67,59.69 0,59.69
GND1
  Top 0.406: R34.1 59.69,47.2 C23.+ 63.72,43.81 R39.2 65.62,41.91 TP8.TP 67.31,41.27 68.58,41.27 | R33.1 74.05,50.34 Q25.E 69.53,48.58 68.58,47.62 68.58,41.27 | R35.1 68.58,41.27
HP_OUT  (1 unrouted)
  Top 0.152: R102.2 94.4,-43.93 IC13.1
LFO  (via drill 0.5)  (4 unrouted)
  Top 0.152: IC8.5 15.24,-69.85 13.97,-68.58 13.97,-67.31 12.7,-66.04 | 100.97,-40.01 IC13.4 | IC17.13 59.34,-27.02
  Top 0.406: VR5.E 101.6,9.53 108.58,9.53 111.76,6.35 v113.03,6.35 | 133.35,44.45 138.43,39.37 138.43,31.75 139.7,30.48 148.59,30.48 149.86,29.21 FINGERPAD2.A0 FINGERPAD2.A1
  Bottom 0.406: v113.03,6.35 113.03,3.81 114.3,2.54 123.83,2.54 125.09,3.81 125.09,7.62 130.18,12.7 147.32,12.7 149.86,15.24 FINGERPAD2.A1
LFO_CV  (1 unrouted)
  Top 0.152: IC18.2 48.62,-64.42 48.26,-64.77
LFO_RST  (1 unrouted)
  Top 0.152: 2.54,-44.45 C33.2
LFO_SHAPE  (1 unrouted)
  Top 0.152: IC13.9 84.45,-34.92
MISO  (2 unrouted)
MOSI  (3 unrouted)
  Top 0.152: IC12.6 53.66,-51.12 54.61,-52.07 54.61,-63.5 56.2,-65.09 IC18.12
N$1
  Top 0.406: IC1.1 R47.2
N$2
  Top 0.406: D5.C 74.93,15.24 73.03,13.34 R64.1
N$3  (via drill 0.5)
  Top 0.406: Q12.C 92.88,4.62 91.66,3.39 R13.2 86.78,3.39 86.36,3.81 v86.36,5.08 | R14.1 80.64,12.06 81.28,11.43 v81.92,11.43 84.45,13.97 87,13.97 | 87,13.97 88.27,13.97 IC2.3 | IC2.2 87,13.97
  Bottom 0.406: v86.36,5.08 86.36,4.45 84.45,2.54 83.19,2.54 81.92,3.81 v81.92,11.43
N$4
  Top 0.152: IC9.2 10.79,-35.56 8.89,-33.66 5.71,-33.66 3.17,-34.09 | 3.17,-34.09 D12.C | 3.17,-34.09 3.6,-33.66
N$6
  Top 0.406: C22.2 R40.2 94.3,17.36 IC2.8
N$7
  Top 0.406: Q12.B 95.08,4.4 R54.2
N$8
  Top 0.406: C16.1 89.55,5.5 D2.C 88.06,8.68 R20.2 90.17,8.89 90.81,9.53 IC2.5 90.81,13.97 92.08,13.97 IC2.6
N$9  (via drill 0.5)
  Top 0.406: R47.1 48.9,15.88 50.8,13.97 v56.52,13.97 | v76.83,16.51 77.67,16.51 D6.C | IC2.12 88.27,16.51 v83.82,16.51 | v83.82,5.08 v80.64,5.08
  Bottom 0.406: 74.93,3.81 69.22,3.81 66.67,6.35 66.67,11.43 64.14,13.97 v56.52,13.97 | 74.93,3.81 76.2,5.08 76.2,8.89 74.93,10.16 74.93,14.61 v76.83,16.51 | v83.82,16.51 v83.82,5.08 | v80.64,5.08 79.38,3.81 74.93,3.81
N$10
  Top 0.406: R77.1 64.76,16.08 D4.A
N$11
  Top 0.152: IC9.9 D17.A
N$12
  Top 0.406: R64.2 73.03,8.89 VR3.A
N$13
  Top 0.152: D19.A R82.2
N$14
  Top 0.406: R54.1 99.23,3.17 Q11.C
N$15
  Top 0.406: Q11.B 103.83,2.86 104.78,3.81 107.1,3.81 R15.2
N$16
  Top 0.406: R72.2 102.87,17.78 | 102.87,17.78 VR5.S | R61.1 107.31,27.94 106.05,26.67 106.05,22.23 102.87,19.05 102.87,17.78
N$17  (1 unrouted)
  Top 0.152: IC9.11 8.89,-33.02 10.79,-34.92 14.61,-34.92 15.24,-34.29 17.14,-34.29 17.78,-33.66 17.78,-30.48 IC5(P6).1
N$18
  Top 0.406: R10.2 R59.2 117.47,31.75 116.2,30.48 111.97,30.48 | 111.97,25.4 R61.2 111.97,30.48 | 111.97,25.4 R5.2 | R9.2 111.97,25.4 | IC3.2 111.76,32.8 R21.1 111.97,31.75 111.97,30.48
N$19
  Top 0.152: D18.C IC5(P3).1
N$20
  Top 0.406: R66.1 137.79,11.43 VR4.A R46.2
N$21  (via drill 0.5)
  Top 0.406: R43.2 v121.28,17.14 | v125.09,17.14 130.81,17.14 VR4.S 134.2,17.78 R66.2
  Bottom 0.406: v121.28,17.14 v125.09,17.14
N$22  (via drill 0.5)
  Top 0.406: IC3.1 110.49,34.29 109.86,33.66 109.86,32.6 R21.2 v107.31,32.38 | v102.87,32.38 101.81,31.33 R25.1
  Bottom 0.406: v107.31,32.38 v102.87,32.38
N$23  (1 unrouted)
  Top 0.152: R78.2 62.65,-5.93
  Top 0.406: 100.33,33.02 100.33,35.56 100.97,36.2 100.97,38.1 99.69,39.37 97.94,39.37 Q16.B | 100.33,33.02 100.33,31.33 R25.2 | R30.2 100.33,33.02
N$24
  Top 0.406: 102.87,46.35 115.57,46.35 117.47,44.45 R59.1
N$25
  Top 0.406: R63.2 123.19,25.4 | 123.19,25.4 R9.1 | R48.2 123.19,25.4
N$26
  Top 0.406: R10.1 T1.S
N$27
  Top 0.406: 96.52,48.9 96.52,46.82 Q17.C 94.61,40.85 R75.2 | Q8.C 105.41,52.53 105.41,50.8 104.14,49.53 99.69,49.53 99.06,48.9 96.52,48.9 | 96.52,48.9 C13.2
N$28
  Top 0.406: R17.2 88.9,53.98 89.53,54.61 95.89,54.61 96.52,53.98 99.48,53.98 R16.1 100.23,53.66 Q8.B
N$29  (1 unrouted)
  Top 0.152: D11.C 77.47,-2.54
  Top 0.406: R32.1 102.87,42.55 104.78,44.45 C21.2 110.28,44.03 111.76,42.55 IC3.7
N$30
  Top 0.406: R32.2 95.73,42.55 Q17.E Q16.E
N$31  (via drill 0.5)
  Top 0.406: R19.1 v95.25,36.83 95.89,37.47 96.35,37.47 Q16.C | v102.23,44.45 102.87,44.45 104.14,45.72 112.39,45.72 113.03,45.09 113.03,44.45 | IC3.6 113.03,44.45 | C21.1 113.03,44.45
  Bottom 0.406: v102.23,44.45 99.69,44.45 95.89,40.64 95.89,37.47 v95.25,36.83
N$32
  Top 0.406: Q9.C 89.53,48.26 88.9,48.9 | 88.9,48.9 R18.2 | R17.1 88.9,48.9
N$33
  Top 0.406: R75.1 92.75,37.3 Q18.B 91.12,38.63 R76.2
N$34
  Top 0.406: Q18.E Q19.B
N$35
  Top 0.61: BAT+.TP 21.59,7.62 SW1.1
N$36
  Top 0.406: R11.1 92.08,48.41 Q9.B 90.78,44.91 Q13.C
N$37
  Top 0.406: 85.72,42.55 R26.2 84.88,42.75 | 85.72,42.55 87.78,42.55 Q13.B | D1.A 85.72,40.01 85.72,42.55 | R18.1 86.14,42.97 85.72,42.55
N$38
  Top 0.406: D10.A R76.1
N$39  (via drill 0.5)
  Top 0.406: Q1.E 37.78,56.2 38.73,55.24 | 38.73,55.24 C8.1 | 38.73,55.24 Q4.C 41.68,54.38 | 41.68,54.38 41.76,54.3 Q4.B | C7.1 55.88,43.18 TP1.TP 54.61,44.45 v53.98,44.45 | v41.27,53.34 41.68,53.74 41.68,54.38
  Bottom 0.406: v53.98,44.45 53.34,45.09 53.34,47.62 48.9,52.7 41.91,52.7 v41.27,53.34
N$40
  Top 0.406: Q2.E 38.63,52.38 C8.2 39.76,52.49 Q5.C 41.76,50.48 Q5.B 44.77,50.48 TP4.TP 50.8,44.45 50.8,41.27 51.44,40.64 52.7,40.64 53.34,40.01 C9.2
N$41  (1 unrouted)
  Top 0.406: Q1.B 36.51,54.3 35.56,55.24 35.56,55.88 34.92,56.52 33.66,56.52 31.75,54.61 R1.1 31.54,52.7 29.84,52.7 27.3,50.16 C6.+
N$42  (via drill 0.5)
  Top 0.406: v71.12,53.34 70.48,53.98 63.5,53.98 62.06,52.53 Q21.E 60.96,53.48 60.96,55.09 Q20.E | v76.83,53.34 78.11,52.07 Q23.C
  Bottom 0.406: v71.12,53.34 v76.83,53.34
N$43
  Top 0.406: Q4.E 44.13,56.2 45.09,55.24 | 45.09,55.24 C11.1 | 45.09,55.24 Q6.C 48.11,54.3 Q6.B
N$44
  Top 0.406: Q5.E 43.12,52.49 C11.2 46.77,50.8 Q7.C 48.11,50.48 Q7.B
N$45
  Top 0.406: Q20.B 63.01,55.24 66.67,55.24 | 66.67,55.24 74.3,55.24 | 74.3,55.24 R31.2 | R33.2 74.3,55.24 | R56.2 66.67,56.3 66.67,55.24
N$46
  Top 0.406: Q6.E 50.48,56.2 51.44,55.24 | 51.44,55.24 C12.1 | 51.44,55.24 Q14.C 54.46,54.3 Q14.B
N$47
  Top 0.406: Q7.E 50.1,52.49 C12.2 52.49,51.44 Q15.C 54.46,50.48 Q15.B
N$48
  Top 0.406: Q14.E 56.84,56.2 57.78,55.24 | 57.78,55.24 C17.1 | Q20.C 57.78,55.24
N$49
  Top 0.406: Q15.E 55.81,52.49 C17.2 58.84,51.44 Q21.C
N$50
  Top 0.406: R67.2 62.16,50.59 Q21.B 59.38,50.48 57.78,48.9 57.78,47.84 R34.2 R27.1
N$51
  Top 0.406: C7.2 55.88,34.71 R3.1
N$52
  Top 0.406: C9.1 53.34,37.47 53.98,36.83 53.98,35.77 R4.1
N$53
  Top 0.406: R3.2 52.07,33.02 51.44,32.38 51.44,30.9 R2.1 51.44,30.06 IC1.6
N$54  (via drill 0.5)
  Top 0.406: 52.27,35.34 R4.2 | R4.2 52.7,35.56 | v53.34,31.75 53.34,28.57 IC1.5 | v53.34,34.29 53.34,34.71 R4.2 | R6.2 51.22,35.34 51.44,35.56 R4.2
  Bottom 0.406: v53.34,34.29 v53.34,31.75
N$55
  Top 0.406: Q23.B 77.79,48.58 78.11,48.26 78.11,45.09 77.95,45.09 Q24.E 77,42.3 R41.1
N$56
  Top 0.406: Q25.C 64.39,52.53 R67.1
N$57
  Top 0.406: Q25.B 67.63,49.22 66.67,48.26 64.14,48.26 63.5,47.62 63.5,45.94 R65.2
N$58
  Top 0.406: R27.2 52.07,47.62 | 52.07,47.62 C15.- | TP5.TP 52.07,47.62
N$59
  Top 0.406: C15.+ 46.35,43.18 | 46.35,43.18 46.35,44.94 Q10.E | R23.2 39.37,46.35 43.18,42.55 45.72,42.55 46.35,43.18
N$60  (1 unrouted)
N$61
  Top 0.406: 46.35,35.56 47.41,35.56 R28.2
N$62  (1 unrouted)
N$63  (via drill 0.5)  (1 unrouted)
  Top 0.406: R74.2 v86.36,55.88 86.36,57.57 R50.2 | Q24.B 75.25,46.03 | 75.25,46.03 74.3,45.09 v74.3,43.81 R49.2 | R42.2 78.53,40.42 v78.11,40.01 | R52.2 58.42,40.01 57.15,41.27 57.15,45.09 v57.78,45.72 | v62.87,48.9 64.77,48.9 66.04,50.16 66.04,51.44 v71.12,51.44 | 75.25,46.03 75.25,48.58 v76.2,49.53
  Bottom 0.406: v78.11,40.01 75.56,40.01 74.3,41.27 v74.3,43.81 | v57.78,45.72 58.42,46.35 60.96,46.35 62.23,47.62 62.23,48.26 v62.87,48.9 | v71.12,51.44 73.03,49.53 v76.2,49.53 80.01,49.53 v86.36,55.88
N$64  (via drill 0.5)
  Top 0.406: SW1.5 17.14,17.14 18.41,18.41 20.32,18.41 20.95,19.05 20.95,21.59 20.32,22.23 v20.32,23.5 | v20.32,29.21 27.3,29.21 29.21,31.11 v29.84,31.11 | v55.24,30.48 57.78,30.48 R57.1
  Bottom 0.406: v20.32,23.5 v20.32,29.21 | v29.84,31.11 52.07,31.11 52.7,30.48 v55.24,30.48
N$65  (1 unrouted)
N$66  (1 unrouted)
  Top 0.406: R52.1 58.42,34.92 | 58.42,34.92 59.69,34.92 | 58.42,34.92 57.78,34.29 R57.2
N$67
  Top 0.406: 123.83,57.78 R50.1 | R51.2 123.83,57.78 | 123.83,57.78 137.16,57.78 145.41,49.53 148.37,49.53 149.86,48.04 PAD1.B1 PAD1.B0
N$68
  Top 0.406: R31.1 C19.2
N$69
  Top 0.406: R56.1 64.56,57.15 C30.2
N$70
  Top 0.406: C30.1 23.5,57.15 22.78,56.44 J2.1
N$71
  Top 0.406: C31.2 38.1,41.27 37.47,40.64 37.47,37.47 36.52,36.52 Q26.B | R68.2 33.66,42.55 34.92,41.27 34.92,37.47 35.88,36.52 Q26.B | Q26.B 36.2,36.34 R69.1
N$72
  Top 0.406: R70.1 33.66,37.3 Q26.C 32.23,37.47 Q3.B
N$73
  Top 0.406: R71.2 34.29,44.45 36.2,42.55 36.2,38.59 Q26.E
N$74
  Top 0.406: Q3.E 30.02,37.3 | Q3.E 30,37.47 29.84,37.47 27.3,34.92 R7.2 | C10.+ 28.73,38.73 Q3.E
N$75
  Top 0.406: R8.2 24.13,38.73 | 24.13,38.73 C10.- | 24.13,38.73 J1.1
N$76
  Top 0.406: Q28.B Q27.E
N$77
  Top 0.406: PAD1.A0 PAD1.A1 141.82,48.68 R62.1
N$78
  Top 0.406: Q28.E 112.43,49.7 D7.A
N$79
  Top 0.406: D7.C D8.A
N$80
  Top 0.406: D8.C 116.2,49.1 D9.A
N$81
  Top 0.406: R74.1 117.91,55.88 D9.C 120.23,55.04 R73.2
N$82
  Top 0.406: R63.1 139.7,25.4 141.6,27.3 FINGERPAD2.B0 FINGERPAD2.B1
N$83
  Top 0.406: IC4.7 8.26,24.77 7.62,25.4 5.08,25.4 4.45,26.04 4.45,30.48 5.71,31.75 C20.+
N$84
  Top 0.406: C14.+ 10.79,24.77 9.53,23.5 IC4.8
N$85
  Top 0.406: R12.1 10.79,30.48 9.53,29.21 IC4.1
N$86
  Top 0.406: C14.- 13.34,28.57 13.34,30.48 R12.2
N$87
  Top 0.406: 4.03,20.95 C18.1
  Top 0.61: 5.71,20.95 5.71,19.68 6.99,18.41 12.06,18.41 13.97,16.51 13.97,15.24 12.7,13.97 11.43,13.97 10.16,12.7 10.16,8.26 13.34,5.08 C5.+ | IC4.5 5.71,20.95 | 5.71,20.95 4.03,20.95
N$88
  Top 0.406: R24.2 16.51,29.21 13.34,26.04 8.26,26.04 6.99,27.3 IC4.3
N$89
  Top 0.406: C5.- X2.1
N$90
  Top 0.406: J1.2 18.2,38.73 R22.1
N$91
  Top 0.406: C18.2 R36.2
N$92
  Top 0.152: D11.A R29.E
N$93
  Top 0.406: 16.51,34.92 R38.2 | R24.1 16.51,34.92 | R22.2 18.41,36.83 16.51,34.92
N$94
  Top 0.406: R60.1 18.41,20.54 LED1.A
N$95  (1 unrouted)
N$96
  Top 0.152: R29.S R78.1
N$97
  Top 0.152: D13.A D14.A 15.67,-36.83 | 15.67,-36.83 D15.A | 15.67,-36.83 15.24,-36.83 14.61,-36.2 10.16,-36.2 9.53,-35.56 IC9.13 6.77,-35.56 R125.1
N$98
  Top 0.406: IC5.6 117.47,16.73 R43.1 117.89,18.84 C24.1
N$100
  Top 0.152: IC16.9 85.51,-67.31 R107.1 85.09,-67.94 | R108.2 85.09,-67.94 | 85.09,-67.94 82.75,-67.94 82.75,-66.67 D19.C
N$101
  Top 0.152: IC9.3 10.79,-34.29 8.89,-32.38 5.51,-32.38 D16.C 3.6,-32.38
N$102
  Top 0.406: VR2.A 46.99,10.16 60.54,10.16 R77.2
N$103
  Top 0.152: IC9.12 5.71,-34.29 5.71,-34.92 3.81,-36.83 3.81,-37.26 D18.A 2.97,-40.63 2.96,-40.64 R84.2
N$105
  Top 0.152: IC11.1 146.05,-54.73 R98.1
N$106  (1 unrouted)
N$107
  Top 0.152: R109.1 81.28,-70.7 | 81.28,-70.7 R108.1 | 81.28,-70.7 81.28,-72.39 82.55,-73.66 86.36,-73.66 87.63,-72.39 IC16.13 IC16.14
N$108
  Top 0.152: R84.1 0.42,-41.91 R81.2 C33.1
N$109
  Top 0.152: IC14.2 124.46,-54.61 124.46,-50.8 IC14.5
N$110  (1 unrouted)
N$111
  Top 0.152: IC10.3 R88.2 R87.2
N$112
  Top 0.152: IC10.4 132.5,-16.51 R91.2
N$113  (1 unrouted)
N$114
  Top 0.152: R98.2 146.05,-59.69 144.78,-60.96 144.78,-64.77 146.05,-66.04 IC15.4
N$115
  Top 0.152: R100.2 140.97,-61.7 IC15.8
N$116  (2 unrouted)
  Top 0.152: IC10.14 121.5,-17.78
N$117  (1 unrouted)
N$118  (2 unrouted)
  Top 0.152: IC9.10 10.16,-31.75
N$119
  Top 0.152: IC15.9 IC15.10 144.15,-64.77 | IC15.3 IC15.2 | IC11.5 148.59,-49.53 149.86,-50.8 149.86,-57.15 148.59,-58.42 145.41,-58.42 144.15,-59.69 144.15,-64.77 | 147.32,-67.31 IC15.3 | 144.15,-64.77 144.15,-66.04 145.41,-67.31 IC15.3
N$120  (1 unrouted)
N$121
  Top 0.152: IC15.11 R92.2
N$122  (1 unrouted)
  Top 0.152: IC11.7 IC11.6
N$123
  Top 0.152: IC11.9 138.85,-48.26 R99.1 R93.2
N$124
  Top 0.152: IC14.3 119.38,-53.34 118.75,-52.7 114.94,-52.7 114.3,-52.07 114.3,-46.99 115.57,-45.72 123.19,-45.72 127,-49.53 127,-55.88 128.27,-58.42 140.97,-58.42 R100.1 IC11.14
N$125
  Top 0.152: C34.2 R95.1
N$126  (1 unrouted)
  Top 0.152: R102.1 -6.77,-68.15 R103.2 -9.74,-68.58
N$127  (2 unrouted)
N$128
  Top 0.152: R104.2 R105.E
N$129  (1 unrouted)
N$130
  Top 0.152: R106.2 R105.A
N$131
  Top 0.152: Q31.C R109.2 79.16,-69 80.01,-69.85 86.36,-69.85 87.63,-68.58 IC16.10
N$132  (1 unrouted)
N$133
  Top 0.152: R110.2 80.28,-63.08 Q31.B
N$134
  Top 0.152: IC8.1 20.32,-74.93 LED3.A LED4.K
N$135  (3 unrouted)
N$137
  Top 0.152: LED2.A 96.52,-66.04 IC16.7
N$138
  Top 0.152: R111.2 99.91,-65.19 LED2.K IC16.6
N$139
  Top 0.152: IC8.2 LED3.K | LED3.K LED4.A | LED3.K R113.2
N$140
  Top 0.152: R113.1 16.99,-69 IC8.6 IC8.7
N$141  (via drill 0.5)
  Top 0.406: IC5.3 117.47,6.77 R44.1 120.02,6.35 v120.02,12.7 | D3.A 106.05,13.34 107.31,12.06 v111.76,12.06 | v120.02,20.95 R45.2
  Bottom 0.406: v111.76,12.06 112.39,12.7 v120.02,12.7 v120.02,20.95
N$142  (1 unrouted)
N$143
  Top 0.152: IC17.12 61.12,-27.68 R79.1 61.38,-29.21 R121.2
N$144
  Top 0.152: R79.2 63.08,-30.48 R80.2 R120.2 | IC3A(P2).1 R120.2 | R124.2 67.31,-42.76 67.31,-31.75 66.46,-30.9 R120.2
N$145  (1 unrouted)
N$151  (1 unrouted)
N$152
  Top 0.152: IC16.2 96.1,-72.39 R126.1 R112.2
N$153  (1 unrouted)
N$155
  Top 0.152: 140.8,-17.46 140.8,-18.41 | 140.8,-18.41 Q34.E | R128.1 138.65,-18.41 140.8,-18.41
  Top 0.406: Q35.E 140.8,-17.46
N$156
  Top 0.152: Q35.B 139.28,-15.56 | 141.39,-15.56 R130.2
  Top 0.406: 139.28,-15.56 R129.1 | Q35.B 141.39,-15.56
N$157
  Top 0.152: R131.2 R132.2 141.12,-21.59 Q34.B
  Top 0.406: 142.66,-18.73 R131.2
N$158  (1 unrouted)
NEW_ENV  (3 unrouted)
  Top 0.152: IC16.8 85.94,-66.04 R107.2 | 90.17,-64.71 IC16.8 | IC16.8 90.17,-66.04 92.71,-68.58 IC16.5
PUL1_SW  (1 unrouted)
  Top 0.152: IC15.5 151.13,-64.77 152.4,-66.04
PUL2_SW  (1 unrouted)
REL_PWM  (1 unrouted)
RES_OUT  (2 unrouted)
  Top 0.406: Q10.B 44.13,45.4
SAW  (2 unrouted)
  Top 0.152: R126.2 95.67,-73.66 IC16.1 92.71,-73.66 | R93.1 138.43,-52.07 139.7,-53.34 IC11.13 | 91.44,-53.34 83.82,-45.72 83.82,-40.64 85.72,-38.73 IC13.12
SAW_CV  (1 unrouted)
  Top 0.152: IC11.12 142.88,-52.07 144.15,-53.34 IC11.2
SAW_OUT  (1 unrouted)
  Top 0.152: IC13.14 86.36,-41.27
SAW_SW  (1 unrouted)
  Top 0.152: IC15.13 138.43,-68.58 137.16,-69.85
SCK  (3 unrouted)
  Top 0.152: IC18.11 58.08,-65.75 58.42,-65.41 58.42,-64.77 56.52,-64.77 55.24,-63.5 55.24,-52.07 53.65,-50.48 IC12.5
SQR  (via drill 0.5)  (1 unrouted)
  Top 0.152: IC13.5 100.33,-38.73 | 100.33,-38.73 103.5,-38.73 103.5,-33.66 111.76,-25.4 116.84,-25.4 119.38,-27.94 121.92,-27.94 121.92,-26.04 128.27,-19.68 132.08,-19.68 132.72,-20.32 132.72,-21.59 135.25,-21.59 135.25,-20.54 R87.1 | SQR.1 100.33,-38.73
  Top 0.406: IC5.1 114.94,6.77 R44.2 114.94,6.35 v114.94,3.81 | 123.83,3.81 125.09,3.81 VR4.E 130.18,8.89 | 123.83,3.81 v120.02,3.81 | v123.83,27.94 126.36,30.48 132.08,30.48 135.25,33.66 135.25,39.37 132.72,41.91 | v123.83,13.34 123.83,3.81
  Bottom 0.406: v120.02,3.81 v114.94,3.81 | v123.83,27.94 127.64,24.77 127.64,16.51 125.09,13.34 v123.83,13.34
STRIP  (via drill 0.5)  (1 unrouted)
  Top 0.406: Q27.B 106.36,48.58 106.68,48.26 109.22,48.26 v109.86,47.62 | v109.86,26.04 109.86,23.91 R5.1 110.49,23.28 TP3.TP 109.86,20.95 v109.86,17.78 | H1.B2,8 8.47,1.69 R55.2 R13.1 107.31,1.69 | 107.31,1.69 110.28,1.69 v109.86,1.91 | R15.1 107.31,1.69
  Bottom 0.406: v109.86,47.62 v109.86,26.04 | v109.86,1.91 v109.86,17.78
SUB_OSC
  Top 0.152: R92.1 R94.1 122.77,-55.88 IC14.1
SUB_SW  (1 unrouted)
  Top 0.152: 137.16,-67.31 IC15.12
SUS_CV  (1 unrouted)
  Top 0.152: IC18.1 48.52,-63.77 48.26,-63.5
TRI  (via drill 0.5)  (2 unrouted)
  Top 0.152: IC13.3 99.06,-41.27 99.69,-41.91 TRI.1 | R85.2 20.32,-44.45
  Top 0.406: IC5.7 115.99,14.24 C24.2 R45.1 115.99,23.07 v115.57,23.5 | v119.38,28.57 124.46,33.66
  Bottom 0.406: v115.57,23.5 118.11,23.5 119.38,24.77 v119.38,28.57
TRI_SW  (2 unrouted)
  Top 0.152: IC13.11 83.19,-37.47
V+
  Top 0.61: 26.67,27.3 C26.+ 18.41,27.3 17.14,26.04 17.14,21.17 R60.2 | 26.67,27.3 27.3,27.3 TP13.TP 29.21,29.84 35.31,29.84 IC6.3 | C27.1 26.67,27.3 | IC4.6 6.99,21.59 8.26,20.32 15.24,20.32 | 15.24,20.32 R60.2 | 17.14,20.32 R60.2 | 15.24,13.97 17.78,13.97 SW1.2 | SW1.0 13.34,12.06 15.24,13.97 | 15.24,13.97 15.24,20.32
VCA_CV  (1 unrouted)
VCA_OUT  (1 unrouted)
VCC  (1 unrouted)
VCF_CV  (1 unrouted)
  Top 0.152: IC18.5 48.59,-66.36 48.26,-66.04
  Top 0.406: VR6.S 70.91,46.77 R49.1
VCF_MODE  (1 unrouted)
  Top 0.152: IC13.10 83.19,-36.2
VCF_OUT  (4 unrouted)
  Top 0.152: R103.1 -6.35,-69.85 -5.08,-68.58 97.79,-44.45 95.89,-42.55 IC13.2
  Top 0.406: TP2.TP 46.35,30.48 R2.2 49.31,30.06 50.16,29.21 IC1.7 | C31.1 40.22,38.31
VCO  (1 unrouted)
  Top 0.152: C35.1 VCO.1
  Top 0.406: C19.1 82.77,48.26 | 82.77,48.26 82.77,43.38 R26.1 82.23,41.17 82.23,37.78 82.55,37.47 Q19.E 81.75,37.3 80.64,36.2 R37.2 | TP7.TP 82.77,48.26
VCO_CV  (1 unrouted)
VCO_OUT  (2 unrouted)

## Text on the board
tNames: VCO | Tune | Res | VCF1 | VCF2 | VCF-O | Vref2 | VCF Pad | LFO | Bat+ | +5V | SX-150 Mk II | Atk | Gnd | VCO Pad | Strip | Env | LFO | Strip | Vref | Gate | Speaker